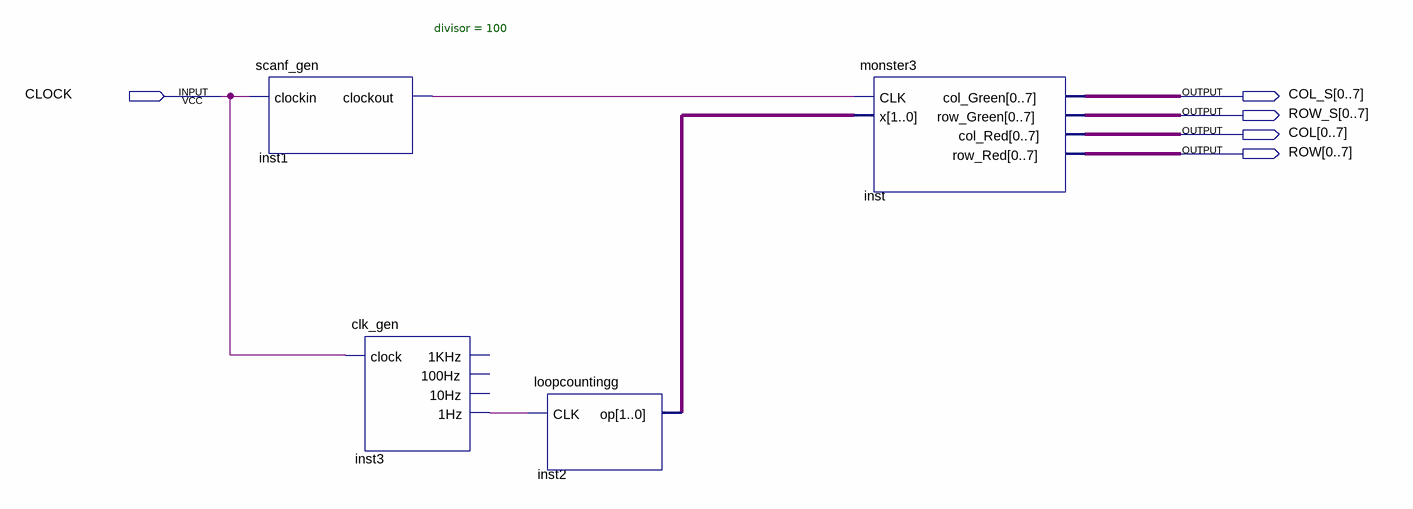
[diagram p0: schematic sheet]
// Quartus schematic 8X8.bdf as structural Verilog: 4 symbols, 5 pins
module \8X8  (
  input  CLOCK,
  output [0:7] COL_S,
  output [0:7] ROW_S,
  output [0:7] COL,
  output [0:7] ROW
);

  wire inst1_clockout, inst3_1hz;
  wire [1:0] inst2_op;

  scanf_gen #(.divisor(100)) inst1 (.clockin(CLOCK), .clockout(inst1_clockout));
  clk_gen inst3 (.clock(CLOCK), .\1Hz (inst3_1hz));  // open: 1KHz, 100Hz, 10Hz
  loopcountingg inst2 (.CLK(inst3_1hz), .op(inst2_op));
  monster3 inst (
    .CLK(inst1_clockout), .x(inst2_op), .col_Green(COL_S), .row_Green(ROW_S), .col_Red(COL), .row_Red(ROW));
endmodule
